# Altium schematic sheet EMI_filter.SchDoc
size A4; Author: Mikołaj Pichita; CompanyName: AGH University of Science and Technology; SheetNumber: 3; SheetTotal: 16
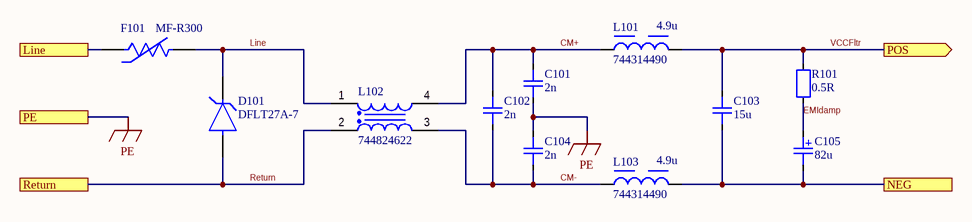
[diagram p0: EMI_filter.SchDoc]

## Parts
C101  2n  [CAP0603]
C102  2n  [CAP0603]
C103  15u  [CAP2220]
C104  2n  [CAP0603]
C105  82u  [WCAP-PSLC_D8H11.7]
D101  DFLT27A-7  [FP-PowerDI123-MFG]
F101  MF-R300  [FP-MF-R300-MFG]
L101  744314490  [WE-HCI_7050]
L102  744824622  [WE-CMB_Type L_L27.5W18.5H33]
L103  744314490  [WE-HCI_7050]
R101  0.5R  [RES0603]

## Ports
Line (see main[1A]), NEG (see main[1A]), PE (see main[1A]), POS (out, see main[1A]), Return (see main[1A])

## Nets
PE: C101.2 C104.1 ; port PE
CM+: C101.1 C102.1 L101.1 L102.4
CM-: C102.2 C104.2 L102.3 L103.1
EMIdamp: C105.1 R101.2
Line: D101.1(C) F101.2 L102.1
Line: F101.1 ; port Line  [a separate net that carries the same name]
NEG: C103.2 C105.2 L103.2 ; port NEG
Return: D101.2(A) L102.2 ; port Return
VCCFltr: C103.1 L101.2 R101.1 ; port POS

## Notes on the sheet
- (near L101) 4.9u
- (near L103) 4.9u
- Nazwa projektu
- Nazwa dokumentu
- Nazwa firmy:
- Autor:
- Osoba sprawdzająca:
- Data:

## Library data of the parts
C101-C105 = Capacitor: Value: *; HelpURL: *; MPN: *; Supplier: *; SupplierPartNumber: *; Supplier 1: Mouser
  C101 C102 C104: Supplier Part Number 1: 80-C0603C202J2G
  C103: Supplier Part Number 1: 810-C5750X7S2A156M
  C105: Supplier Part Number 1: 710-875115652006
D101 = CMP-12828-000010-1: TVS DIODE 27V 43.7V POWERDI 123; Manufacturer: Diodes Inc; Peak Pulse Current: 5.15A; Direction: Unidirectional; Peak Pulse Power: 1125W; Breakdown Voltage: 30V; Number Of Channels: 1; Max Junction Temp: +150°C; Mouser Description: TVS Diodes - Transient Voltage Suppressors TVS UNIDIRECTIONAL; Device Class L1: Circuit Protection; Temperature: -65°C to +150°C; Device Class L3: unset; ComponentLink2URL: https://www.diodes.com/assets/Datasheets/ds30581.pdf; Package: PowerDI123; Reverse Standoff Voltage: 27V; Temperature Range Low: -65°C; RoHS: TRUE; Footprint Url: https://www.diodes.com/assets/Package-Files/PowerDI123.pdf; Category: Diode; Automotive: No; Device Class L2: TVS Diodes; Digikey Description: TVS DIODE 27V 43.7V POWERDI 123; Temperature Range High: +150°C; Octopart: https://octopart.com/dflt27a-7-diodes+inc.-347680; Height: 1mm; ComponentLink2Description: Datasheet; Lead Free: Yes; Manufacturer Part Number: DFLT27A-7; Clamping Voltage: 43.7V
F101 = CMP-07400-000007-1: PTC RESET FUSE 30V 3A RADIAL; Manufacturer: Bourns Inc.; Current Rating: 40A; Trip Current: 6A; Trip Time: 10.8s; Resistance: 0.02-0.08Ω; Value: 0.02-0.08Ω; Temperature Range Low: -40°C; Temperature: -40°C to +85°C; Octopart: https://octopart.com/mf-r300-bourns-15098; Lead Free: Yes; ComponentLink2Description: Datasheet; Height: 18.3mm; Voltage Rating: 30V; Device Class L2: PTC Resettable Fuses; Ambient Temperature Range Low: -40°C; Mouser Description: Resettable Fuses - PPTC 30v Max 40Amps Max Hold 3.0 Trip 6.0; Manufacturer Part Number: MF-R300; Temperature Range High: +85°C; Digikey Description: PTC RESET FUSE 30V 3A RADIAL; Ambient Temperature Range High: +85°C; ComponentLink2URL: https://www.bourns.com/docs/Product-Datasheets/mfr.pdf; Automotive: No; Package: 0; Device Class L1: Circuit Protection; RoHS: TRUE; Category: Fuse; Hold Current: 3A; Device Class L3: unset
L101 L103 = 744314490: NexarPartId: 7864302; Self Resonant Frequency: 56MHz; Max DC Current: 6.5A; Tolerance: 20%; Test Frequency: 100kHz; Inductance: 4.9µH; Shielding: Shielded; Series Resistance: 14.5Ω; DC Resistance (DCR): 14.5mΩ; Case/Package: 7050; Number of Pins: 2; Lead Free: Lead Free; REACH SVHC: Unknown; Mount: Surface Mount; Packaging: Cut Tape (CT); Ambient Temperature Range Low: -40°C; Max Operating Temperature: 150°C; Depth: 7.2mm; Height: 4.8mm; Height - Seated (Max): 5.0038mm; Saturation Current: 6.5A; Military Standard: Not; Composition: Wirewound; Inductance Tolerance: 20%; Ambient Temperature Range High: 100°C; Length: 7mm; RoHS: Compliant; Width: 6.9mm; Resistance: 14.5mΩ; Min Operating Temperature: -40°C; Current Rating: 6.5A; Termination: SMD/SMT; RMS Current (Irms): 6.5A; Supplier 1: Mouser; Supplier Part Number 1: 710-744314490
L102 = 744824622: NexarPartId: 22865134; Inductance Tolerance: 30%; Resistance: 20mΩ; Inductance: 2.2mH; Voltage Rating: 250V; Current Rating: 6A; Pin Length: 5mm; Width: 18.5mm; Ambient Temperature Range Low: -40°C; Min Operating Temperature: -40°C; Ambient Temperature Range High: 70°C; Number of Pins: 4; Packaging: Bulk; Length: 27.5mm; Max Operating Temperature: 125°C; RoHS: Compliant; Height: 33mm; Supplier 1: Mouser; Supplier Part Number 1: 710-744824622
R101 = Resistor: Value: *; HelpURL: *; MPN: *; Supplier: *; SupplierPartNumber: *; Supplier 1: Mouser; Supplier Part Number 1: 71-RCWE0603R500FKEA